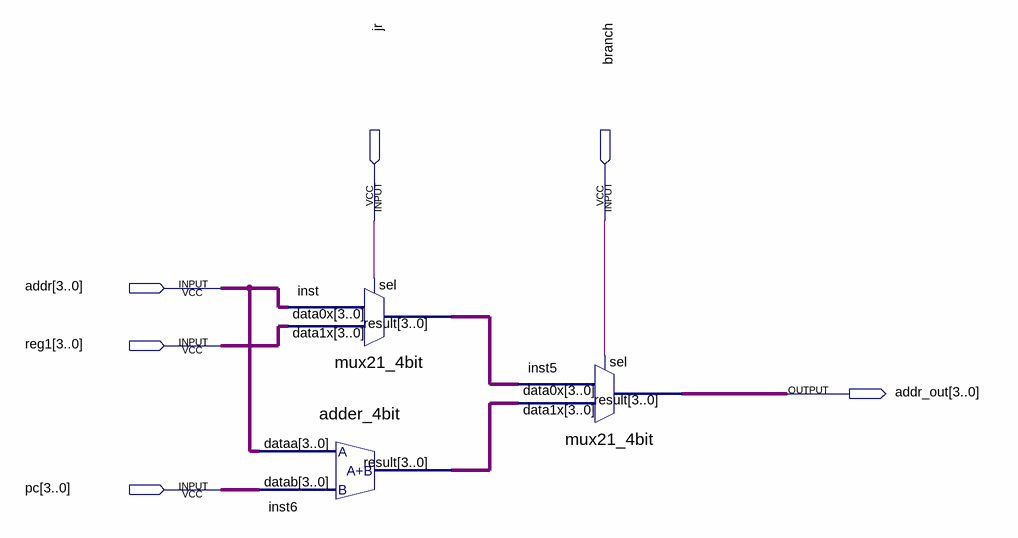
[diagram p0: schematic sheet]
// Quartus schematic jump_sel.bdf as structural Verilog: 3 symbols, 6 pins
module jump_sel (
  input  jr,
  input  branch,
  input  [3:0] addr,
  input  [3:0] reg1,
  input  [3:0] pc,
  output [3:0] addr_out
);

  wire [3:0] inst6_result, inst_result;

  adder_4bit inst6 (.dataa(addr), .datab(pc), .result(inst6_result));
  mux21_4bit inst (.data1x(reg1), .data0x(addr), .sel(jr), .result(inst_result));
  mux21_4bit inst5 (.data1x(inst6_result), .data0x(inst_result), .sel(branch), .result(addr_out));
endmodule
